# EasyEDA schematic SCH.json
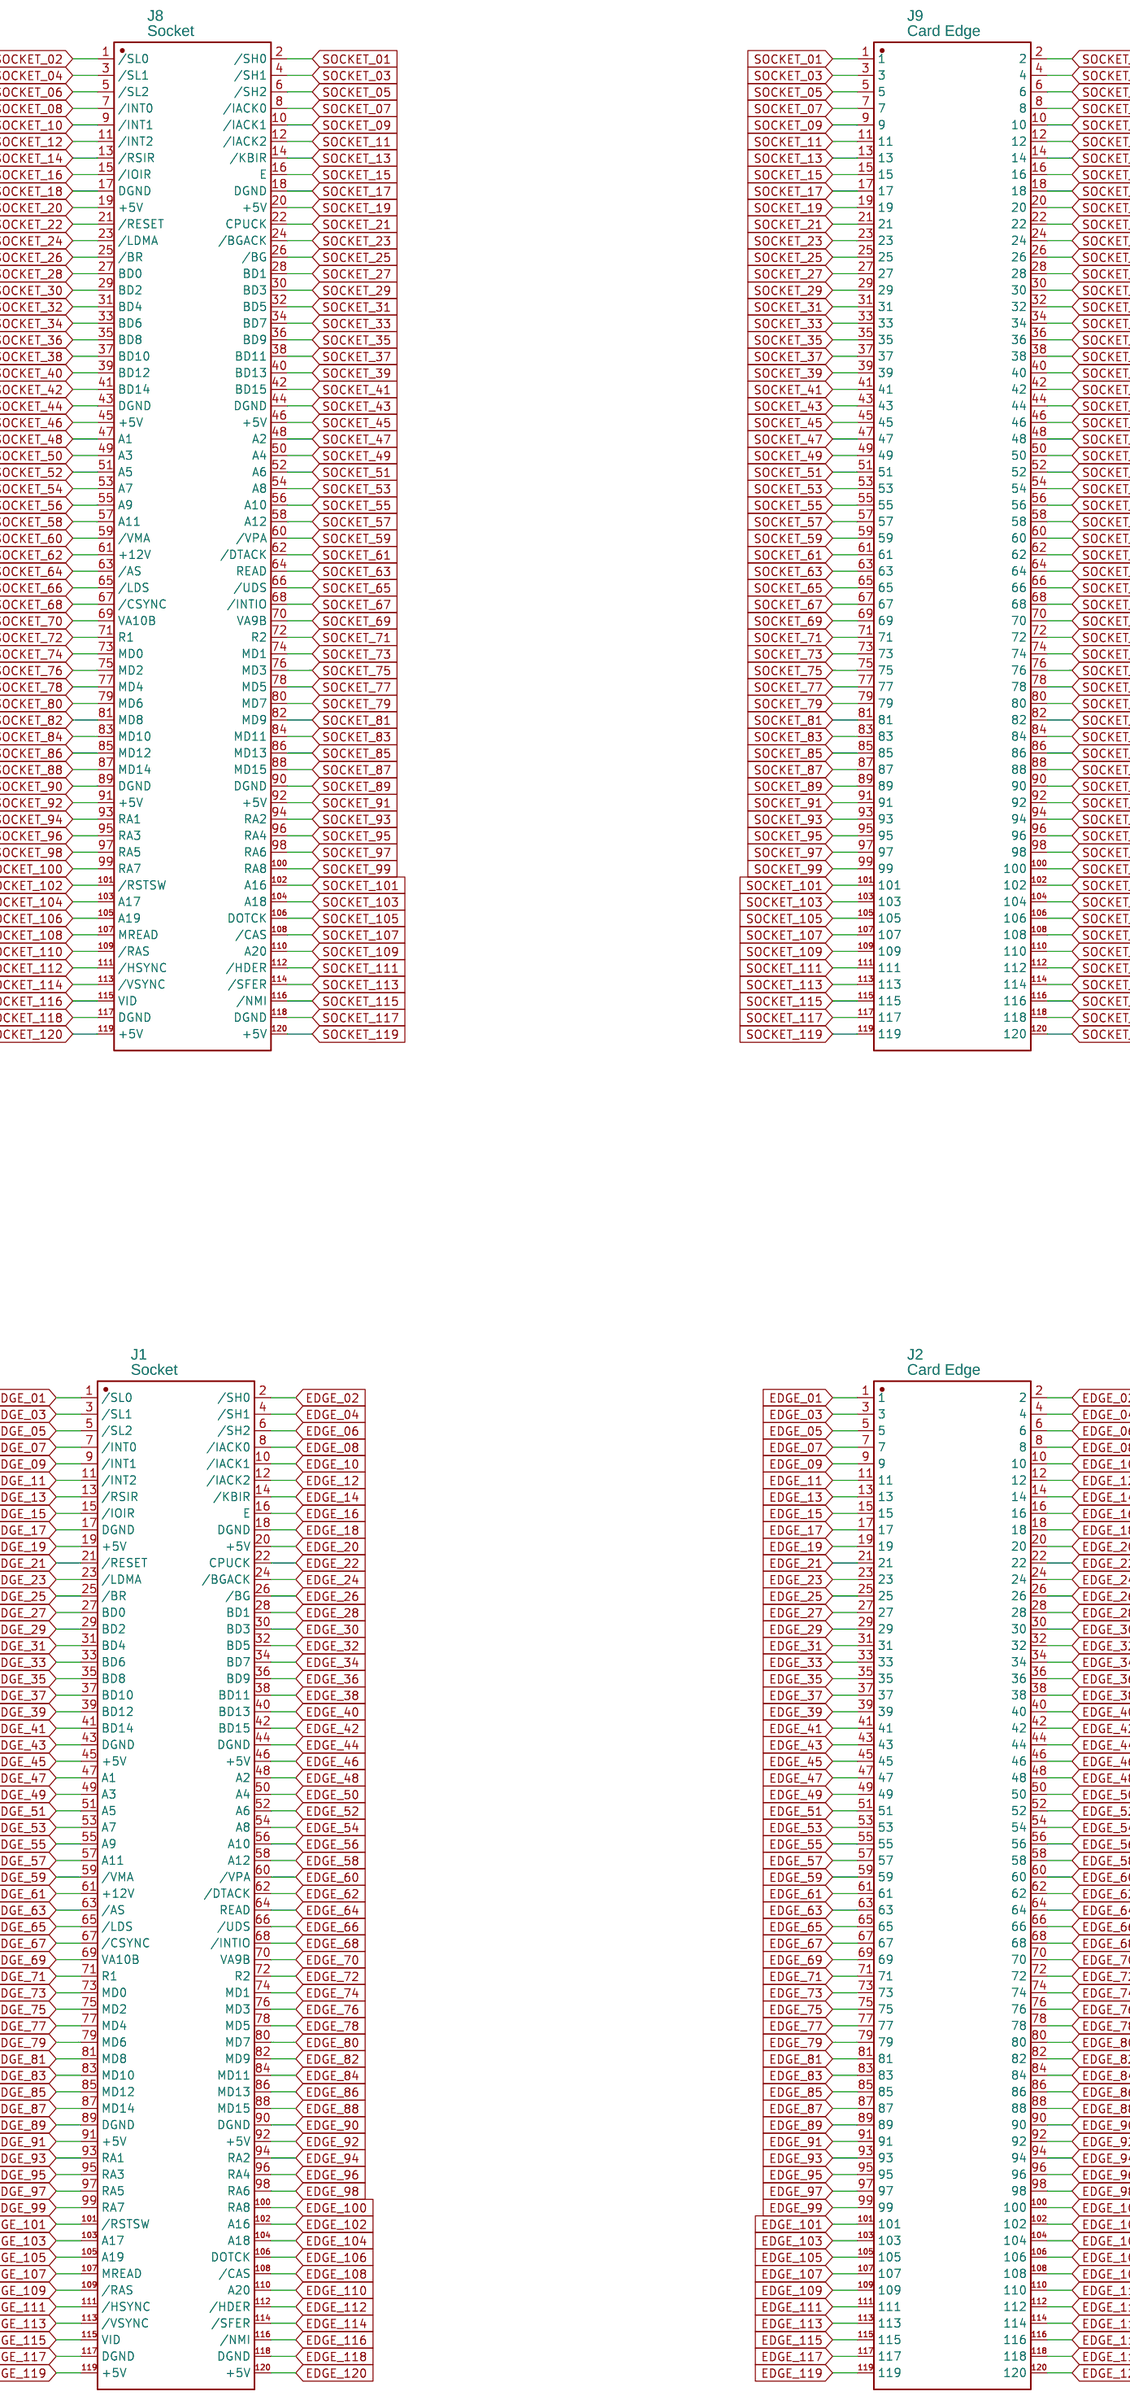
[diagram p0: schematic sheet]

## Parts
J1  Socket  [LISA-120]
J2  Card Edge  [I/O_EDGE_CONNECTOR]
J8  Socket  [LISA-120]
J9  Card Edge  [I/O_EDGE_CONNECTOR]

## Library data of the parts
J1 J2 J8 J9 = Apple Lisa 120-Pin Edge Connector: Manufacturer: EDAC; Manufacturer Part: 345-120-520-201; Supplier: Mouser; Supplier Part: 587-345-120-520-201; Contributor: AlexTheCat123

## Nets
EDGE_01: J1.1(/SL0) J2.1
EDGE_02: J1.2(/SH0) J2.2
EDGE_03: J1.3(/SL1) J2.3
EDGE_04: J1.4(/SH1) J2.4
EDGE_05: J1.5(/SL2) J2.5
EDGE_06: J1.6(/SH2) J2.6
EDGE_07: J1.7(/INT0) J2.7
EDGE_08: J1.8(/IACK0) J2.8
EDGE_09: J1.9(/INT1) J2.9
EDGE_10: J1.10(/IACK1) J2.10
EDGE_11: J1.11(/INT2) J2.11
EDGE_12: J1.12(/IACK2) J2.12
EDGE_13: J1.13(/RSIR) J2.13
EDGE_14: J1.14(/KBIR) J2.14
EDGE_15: J1.15(/IOIR) J2.15
EDGE_16: J1.16(E) J2.16
EDGE_17: J1.17(DGND) J2.17
EDGE_18: J1.18(DGND) J2.18
EDGE_19: J1.19(+5V) J2.19
EDGE_20: J1.20(+5V) J2.20
EDGE_21: J1.21(/RESET) J2.21
EDGE_22: J1.22(CPUCK) J2.22
EDGE_23: J1.23(/LDMA) J2.23
EDGE_24: J1.24(/BGACK) J2.24
EDGE_25: J1.25(/BR) J2.25
EDGE_26: J1.26(/BG) J2.26
EDGE_27: J1.27(BD0) J2.27
EDGE_28: J1.28(BD1) J2.28
EDGE_29: J1.29(BD2) J2.29
EDGE_30: J1.30(BD3) J2.30
EDGE_31: J1.31(BD4) J2.31
EDGE_32: J1.32(BD5) J2.32
EDGE_33: J1.33(BD6) J2.33
EDGE_34: J1.34(BD7) J2.34
EDGE_35: J1.35(BD8) J2.35
EDGE_36: J1.36(BD9) J2.36
EDGE_37: J1.37(BD10) J2.37
EDGE_38: J1.38(BD11) J2.38
EDGE_39: J1.39(BD12) J2.39
EDGE_40: J1.40(BD13) J2.40
EDGE_41: J1.41(BD14) J2.41
EDGE_42: J1.42(BD15) J2.42
EDGE_43: J1.43(DGND) J2.43
EDGE_44: J1.44(DGND) J2.44
EDGE_45: J1.45(+5V) J2.45
EDGE_46: J1.46(+5V) J2.46
EDGE_47: J1.47(A1) J2.47
EDGE_48: J1.48(A2) J2.48
EDGE_49: J1.49(A3) J2.49
EDGE_50: J1.50(A4) J2.50
EDGE_51: J1.51(A5) J2.51
EDGE_52: J1.52(A6) J2.52
EDGE_53: J1.53(A7) J2.53
EDGE_54: J1.54(A8) J2.54
EDGE_55: J1.55(A9) J2.55
EDGE_56: J1.56(A10) J2.56
EDGE_57: J1.57(A11) J2.57
EDGE_58: J1.58(A12) J2.58
EDGE_59: J1.59(/VMA) J2.59
EDGE_60: J1.60(/VPA) J2.60
EDGE_61: J1.61(+12V) J2.61
EDGE_62: J1.62(/DTACK) J2.62
EDGE_63: J1.63(/AS) J2.63
EDGE_64: J1.64(READ) J2.64
EDGE_65: J1.65(/LDS) J2.65
EDGE_66: J1.66(/UDS) J2.66
EDGE_67: J1.67(/CSYNC) J2.67
EDGE_68: J1.68(/INTIO) J2.68
EDGE_69: J1.69(VA10B) J2.69
EDGE_70: J1.70(VA9B) J2.70
EDGE_71: J1.71(R1) J2.71
EDGE_72: J1.72(R2) J2.72
EDGE_73: J1.73(MD0) J2.73
EDGE_74: J1.74(MD1) J2.74
EDGE_75: J1.75(MD2) J2.75
EDGE_76: J1.76(MD3) J2.76
EDGE_77: J1.77(MD4) J2.77
EDGE_78: J1.78(MD5) J2.78
EDGE_79: J1.79(MD6) J2.79
EDGE_80: J1.80(MD7) J2.80
EDGE_81: J1.81(MD8) J2.81
EDGE_82: J1.82(MD9) J2.82
EDGE_83: J1.83(MD10) J2.83
EDGE_84: J1.84(MD11) J2.84
EDGE_85: J1.85(MD12) J2.85
EDGE_86: J1.86(MD13) J2.86
EDGE_87: J1.87(MD14) J2.87
EDGE_88: J1.88(MD15) J2.88
EDGE_89: J1.89(DGND) J2.89
EDGE_90: J1.90(DGND) J2.90
EDGE_91: J1.91(+5V) J2.91
EDGE_92: J1.92(+5V) J2.92
EDGE_93: J1.93(RA1) J2.93
EDGE_94: J1.94(RA2) J2.94
EDGE_95: J1.95(RA3) J2.95
EDGE_96: J1.96(RA4) J2.96
EDGE_97: J1.97(RA5) J2.97
EDGE_98: J1.98(RA6) J2.98
EDGE_99: J1.99(RA7) J2.99
EDGE_100: J1.100(RA8) J2.100
EDGE_101: J1.101(/RSTSW) J2.101
EDGE_102: J1.102(A16) J2.102
EDGE_103: J1.103(A17) J2.103
EDGE_104: J1.104(A18) J2.104
EDGE_105: J1.105(A19) J2.105
EDGE_106: J1.106(DOTCK) J2.106
EDGE_107: J1.107(MREAD) J2.107
EDGE_108: J1.108(/CAS) J2.108
EDGE_109: J1.109(/RAS) J2.109
EDGE_110: J1.110(A20) J2.110
EDGE_111: J1.111(/HSYNC) J2.111
EDGE_112: J1.112(/HDER) J2.112
EDGE_113: J1.113(/VSYNC) J2.113
EDGE_114: J1.114(/SFER) J2.114
EDGE_115: J1.115(VID) J2.115
EDGE_116: J1.116(/NMI) J2.116
EDGE_117: J1.117(DGND) J2.117
EDGE_118: J1.118(DGND) J2.118
EDGE_119: J1.119(+5V) J2.119
EDGE_120: J1.120(+5V) J2.120
SOCKET_01: J8.2(/SH0) J9.1
SOCKET_02: J8.1(/SL0) J9.2
SOCKET_03: J8.4(/SH1) J9.3
SOCKET_04: J8.3(/SL1) J9.4
SOCKET_05: J8.6(/SH2) J9.5
SOCKET_06: J8.5(/SL2) J9.6
SOCKET_07: J8.8(/IACK0) J9.7
SOCKET_08: J8.7(/INT0) J9.8
SOCKET_09: J8.10(/IACK1) J9.9
SOCKET_10: J8.9(/INT1) J9.10
SOCKET_11: J8.12(/IACK2) J9.11
SOCKET_12: J8.11(/INT2) J9.12
SOCKET_13: J8.14(/KBIR) J9.13
SOCKET_14: J8.13(/RSIR) J9.14
SOCKET_15: J8.16(E) J9.15
SOCKET_16: J8.15(/IOIR) J9.16
SOCKET_17: J8.18(DGND) J9.17
SOCKET_18: J8.17(DGND) J9.18
SOCKET_19: J8.20(+5V) J9.19
SOCKET_20: J8.19(+5V) J9.20
SOCKET_21: J8.22(CPUCK) J9.21
SOCKET_22: J8.21(/RESET) J9.22
SOCKET_23: J8.24(/BGACK) J9.23
SOCKET_24: J8.23(/LDMA) J9.24
SOCKET_25: J8.26(/BG) J9.25
SOCKET_26: J8.25(/BR) J9.26
SOCKET_27: J8.28(BD1) J9.27
SOCKET_28: J8.27(BD0) J9.28
SOCKET_29: J8.30(BD3) J9.29
SOCKET_30: J8.29(BD2) J9.30
SOCKET_31: J8.32(BD5) J9.31
SOCKET_32: J8.31(BD4) J9.32
SOCKET_33: J8.34(BD7) J9.33
SOCKET_34: J8.33(BD6) J9.34
SOCKET_35: J8.36(BD9) J9.35
SOCKET_36: J8.35(BD8) J9.36
SOCKET_37: J8.38(BD11) J9.37
SOCKET_38: J8.37(BD10) J9.38
SOCKET_39: J8.40(BD13) J9.39
SOCKET_40: J8.39(BD12) J9.40
SOCKET_41: J8.42(BD15) J9.41
SOCKET_42: J8.41(BD14) J9.42
SOCKET_43: J8.44(DGND) J9.43
SOCKET_44: J8.43(DGND) J9.44
SOCKET_45: J8.46(+5V) J9.45
SOCKET_46: J8.45(+5V) J9.46
SOCKET_47: J8.48(A2) J9.47
SOCKET_48: J8.47(A1) J9.48
SOCKET_49: J8.50(A4) J9.49
SOCKET_50: J8.49(A3) J9.50
SOCKET_51: J8.52(A6) J9.51
SOCKET_52: J8.51(A5) J9.52
SOCKET_53: J8.54(A8) J9.53
SOCKET_54: J8.53(A7) J9.54
SOCKET_55: J8.56(A10) J9.55
SOCKET_56: J8.55(A9) J9.56
SOCKET_57: J8.58(A12) J9.57
SOCKET_58: J8.57(A11) J9.58
SOCKET_59: J8.60(/VPA) J9.59
SOCKET_60: J8.59(/VMA) J9.60
SOCKET_61: J8.62(/DTACK) J9.61
SOCKET_62: J8.61(+12V) J9.62
SOCKET_63: J8.64(READ) J9.63
SOCKET_64: J8.63(/AS) J9.64
SOCKET_65: J8.66(/UDS) J9.65
SOCKET_66: J8.65(/LDS) J9.66
SOCKET_67: J8.68(/INTIO) J9.67
SOCKET_68: J8.67(/CSYNC) J9.68
SOCKET_69: J8.70(VA9B) J9.69
SOCKET_70: J8.69(VA10B) J9.70
SOCKET_71: J8.72(R2) J9.71
SOCKET_72: J8.71(R1) J9.72
SOCKET_73: J8.74(MD1) J9.73
SOCKET_74: J8.73(MD0) J9.74
SOCKET_75: J8.76(MD3) J9.75
SOCKET_76: J8.75(MD2) J9.76
SOCKET_77: J8.78(MD5) J9.77
SOCKET_78: J8.77(MD4) J9.78
SOCKET_79: J8.80(MD7) J9.79
SOCKET_80: J8.79(MD6) J9.80
SOCKET_81: J8.82(MD9) J9.81
SOCKET_82: J8.81(MD8) J9.82
SOCKET_83: J8.84(MD11) J9.83
SOCKET_84: J8.83(MD10) J9.84
SOCKET_85: J8.86(MD13) J9.85
SOCKET_86: J8.85(MD12) J9.86
SOCKET_87: J8.88(MD15) J9.87
SOCKET_88: J8.87(MD14) J9.88
SOCKET_89: J8.90(DGND) J9.89
SOCKET_90: J8.89(DGND) J9.90
SOCKET_91: J8.92(+5V) J9.91
SOCKET_92: J8.91(+5V) J9.92
SOCKET_93: J8.94(RA2) J9.93
SOCKET_94: J8.93(RA1) J9.94
SOCKET_95: J8.96(RA4) J9.95
SOCKET_96: J8.95(RA3) J9.96
SOCKET_97: J8.98(RA6) J9.97
SOCKET_98: J8.97(RA5) J9.98
SOCKET_99: J8.100(RA8) J9.99
SOCKET_100: J8.99(RA7) J9.100
SOCKET_101: J8.102(A16) J9.101
SOCKET_102: J8.101(/RSTSW) J9.102
SOCKET_103: J8.104(A18) J9.103
SOCKET_104: J8.103(A17) J9.104
SOCKET_105: J8.106(DOTCK) J9.105
SOCKET_106: J8.105(A19) J9.106
SOCKET_107: J8.108(/CAS) J9.107
SOCKET_108: J8.107(MREAD) J9.108
SOCKET_109: J8.110(A20) J9.109
SOCKET_110: J8.109(/RAS) J9.110
SOCKET_111: J8.112(/HDER) J9.111
SOCKET_112: J8.111(/HSYNC) J9.112
SOCKET_113: J8.114(/SFER) J9.113
SOCKET_114: J8.113(/VSYNC) J9.114
SOCKET_115: J8.116(/NMI) J9.115
SOCKET_116: J8.115(VID) J9.116
SOCKET_117: J8.118(DGND) J9.117
SOCKET_118: J8.117(DGND) J9.118
SOCKET_119: J8.120(+5V) J9.119
SOCKET_120: J8.119(+5V) J9.120
